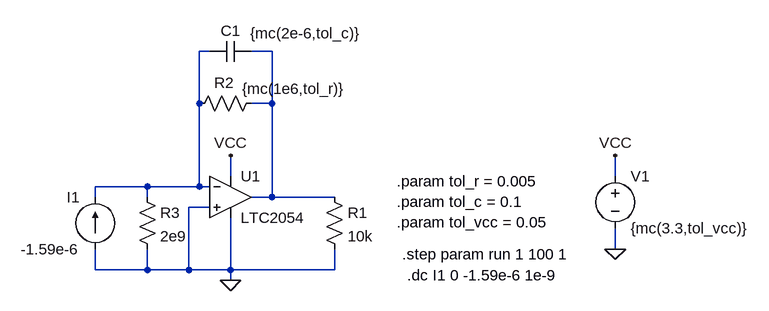
[diagram p0: schematic PhotodiodeAmp.asc]
PhotodiodeAmp.asc, the LTspice schematic file:
Version 4
SHEET 1 1016 680
WIRE 176 -48 160 -48
WIRE 272 -48 240 -48
WIRE 160 32 160 -48
WIRE 272 32 272 -48
WIRE 272 32 240 32
WIRE 208 144 208 112
WIRE 800 144 800 112
WIRE 80 160 0 160
WIRE 160 160 160 32
WIRE 160 160 80 160
WIRE 176 160 160 160
WIRE 0 176 0 160
WIRE 80 176 80 160
WIRE 272 176 272 32
WIRE 272 176 240 176
WIRE 368 176 272 176
WIRE 176 192 144 192
WIRE 800 256 800 224
WIRE 0 288 0 256
WIRE 80 288 80 256
WIRE 80 288 0 288
WIRE 144 288 144 192
WIRE 144 288 80 288
WIRE 208 288 208 208
WIRE 208 288 144 288
WIRE 368 288 368 256
WIRE 368 288 208 288
WIRE 208 304 208 288
FLAG 208 304 0
FLAG 800 256 0
FLAG 800 112 VCC
FLAG 208 112 VCC
SYMBOL Opamps\\LTC2054 208 176 R0
SYMATTR InstName U1
SYMBOL voltage 800 128 R0
WINDOW 123 0 0 Left 2
WINDOW 39 0 0 Left 2
SYMATTR InstName V1
SYMATTR Value {mc(3.3,tol_vcc)}
SYMBOL res 352 160 R0
SYMATTR InstName R1
SYMATTR Value 10k
SYMBOL res 256 16 R90
WINDOW 0 0 58 VBottom 2
WINDOW 3 -22 -50 VTop 2
SYMATTR InstName R2
SYMATTR Value {mc(1e6,tol_r)}
SYMBOL current 0 256 R180
WINDOW 0 24 80 Left 2
WINDOW 3 24 0 Left 2
WINDOW 123 0 0 Left 2
WINDOW 39 0 0 Left 2
SYMATTR InstName I1
SYMATTR Value -1.59e-6
SYMBOL res 64 160 R0
SYMATTR InstName R3
SYMATTR Value 2e9
SYMBOL cap 240 -64 R90
WINDOW 0 0 32 VBottom 2
WINDOW 3 -28 -84 VTop 2
SYMATTR InstName C1
SYMATTR Value {mc(2e-6,tol_c)}
TEXT 464 152 Left 2 !.param tol_r = 0.005\n.param tol_c = 0.1\n.param tol_vcc = 0.05
TEXT 472 264 Left 2 !.step param run 1 100 1
TEXT 480 296 Left 2 !.dc I1 0 -1.59e-6 1e-9

The netlist it stands for:
* PhotodiodeAmp.asc
XU1 0 N001 N002 VCC 0 LTC2054  ; pins In+ In- OUT V+ V-
V1 VCC 0 {mc(3.3,tol_vcc)}
R1 N002 0 10k
R2 N002 N001 {mc(1e6,tol_r)}
I1 0 N001 -1.59e-6
R3 N001 0 2e9
C1 N002 N001 {mc(2e-6,tol_c)}
.param tol_r = 0.005
.param tol_c = 0.1
.param tol_vcc = 0.05
.step param run 1 100 1
.dc I1 0 -1.59e-6 1e-9
.lib LTC2.lib
.backanno
.end